# Altium schematic sheet 5V Buck Boost Converter.SchDoc: 5V DC/DC Buck Boost Converter
size 292 x 193 mm; DocumentNumber: 7; SheetNumber: 3; SheetTotal: 42
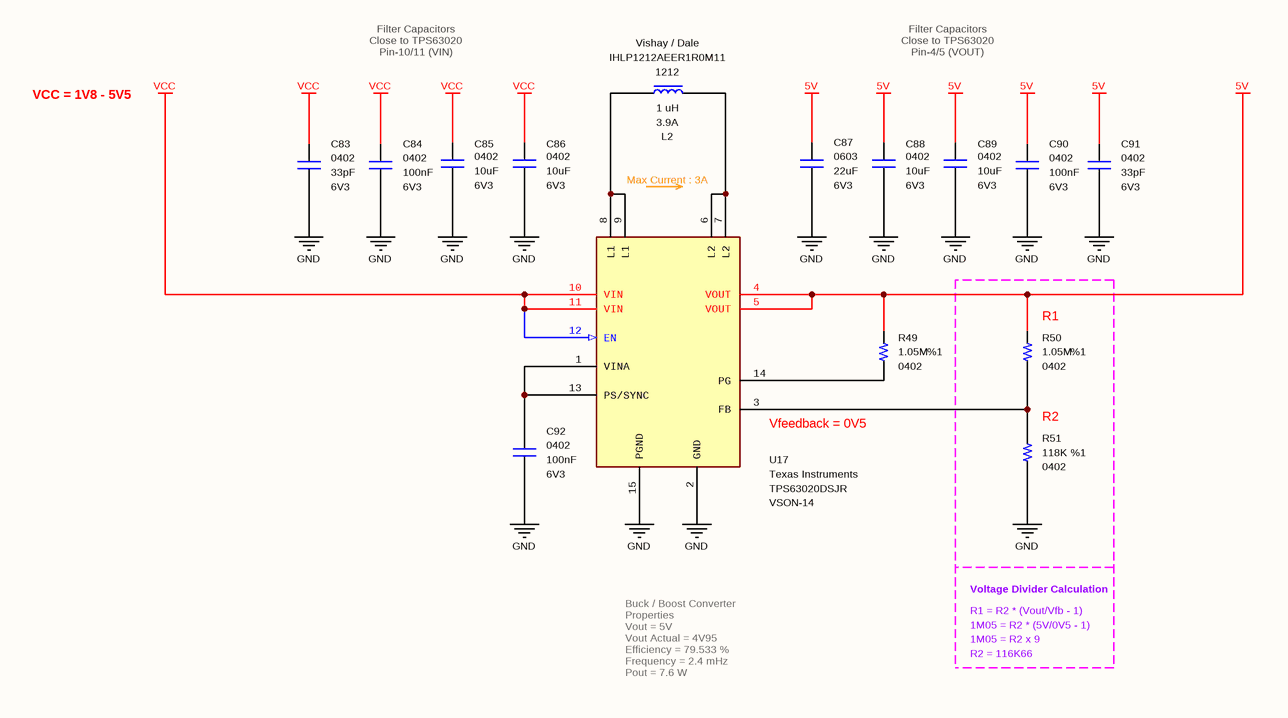
[diagram p0: 5V Buck Boost Converter.SchDoc]

## Parts
C83  value 33pF  Case: 0402  Voltage: 6V3  [CAPACITOR_0402]  (hidden comment: Multilayer Ceramic Capacitor)
C84  value 100nF  Case: 0402  Voltage: 6V3  [CAPACITOR_0402]  (hidden comment: Multilayer Ceramic Capacitor)
C85  value 10uF  Case: 0402  Voltage: 6V3  [CAPACITOR_0402]  (hidden comment: Multilayer Ceramic Capacitor)
C86  value 10uF  Case: 0402  Voltage: 6V3  [CAPACITOR_0402]  (hidden comment: Multilayer Ceramic Capacitor)
C87  value 22uF  Case: 0603  Voltage: 6V3  [CAPACITOR_0603]  (hidden comment: Multilayer Ceramic Capacitors)
C88  value 10uF  Case: 0402  Voltage: 6V3  [CAPACITOR_0402]  (hidden comment: Multilayer Ceramic Capacitor)
C89  value 10uF  Case: 0402  Voltage: 6V3  [CAPACITOR_0402]  (hidden comment: Multilayer Ceramic Capacitor)
C90  value 100nF  Case: 0402  Voltage: 6V3  [CAPACITOR_0402]  (hidden comment: Multilayer Ceramic Capacitor)
C91  value 33pF  Case: 0402  Voltage: 6V3  [CAPACITOR_0402]  (hidden comment: Multilayer Ceramic Capacitor)
C92  value 100nF  Case: 0402  Voltage: 6V3  [CAPACITOR_0402]  (hidden comment: Multilayer Ceramic Capacitor)
L2  value 1 uH  Maximum DC Current: 3.9A  Case: 1212  Manufacturer Part Number: IHLP1212AEER1R0M11  Manufacturer Name: Vishay / Dale  [IHLP-1212]  (hidden comment: Vishay - IHLP1212AEER1R0M11)
R49  value 1.05M  Tolerance: %1  Case: 0402  [RESISTOR_0402]  (hidden comment: Thick Film Resistor)
R50  value 1.05M  Tolerance: %1  Case: 0402  [RESISTOR_0402]  (hidden comment: Thick Film Resistor)
R51  value 118K  Tolerance: %1  Case: 0402  [RESISTOR_0402]  (hidden comment: Thick Film Resistor)
U17  Manufacturer Part Number: TPS63020DSJR  Manufacturer Name: Texas Instruments  [VSON-14]  (hidden comment: Texas Instruments - TPS63020DSJR)

## Nets
5V: C87.2 C88.2 C89.2 C90.1 C91.2 R49.2 R50.2 U17.4(VOUT) U17.5(VOUT)
GND: C83.1 C84.2 C85.1 C86.1 C87.1 C88.1 C89.1 C90.2 C91.1 C92.2 R51.1 U17.2(GND) U17.15(PGND)
VCC: C83.2 C84.1 C85.2 C86.2 U17.10(VIN) U17.11(VIN) U17.12(EN)
NetC92_1: C92.1 U17.1(VINA) U17.13(PS/SYNC)
NetL2_1: L2.1 U17.8(L1) U17.9(L1)
NetL2_2: L2.2 U17.6(L2) U17.7(L2)
NetR49_1: R49.1 U17.14(PG)
NetR50_1: R50.1 R51.2 U17.3(FB)

## Notes on the sheet
- Filter Capacitors
  Close to TPS63020
  Pin-10/11 (VIN)
- Filter Capacitors
  Close to TPS63020
  Pin-4/5 (VOUT)
- VCC = 1V8 - 5V5
- (near R50) R1
- (near U17) Vfeedback = 0V5
- (near R51) R2
- 1M05 = R2 * (5V/0V5 - 1)
- R1 = R2 * (Vout/Vfb - 1)
- Voltage Divider Calculation
- Buck / Boost Converter Properties
  Vout = 5V
  Vout Actual = 4V95
  Efficiency = 79.533 %
  Frequency = 2.4 mHz
  Pout = 7.6 W
- 1M05 = R2 x 9
- R2 = 116K66
- © 2021 All rights reserved.
  This document may not, in whole or in part, be copied, photocopied, reproduced, translated or converted to any electronic or machine readable from without prior written permission of Mehmet Günce Akkoyun.
  Engineer contact : akkoyun@me.com
- Property of
- Engineer :
- Date :
- Size :
- A4
- Time :
- Project :
- Page :
- /
- Customer :
- Product ID :
- Module ID :
- Version :
- File :
- Revision :
- (in symbol IC - TPS63020DSJR) Max Current : 3A

## Library data of the parts
C83 C91 = Capacitor - 33pF [0402-6V3]: Capacitor - 33pF [0402] (Ceramic); Manufacturer Name: Kemet; Manufacturer Part Number: C0402C330J9RACAUTO; Dielectric: X7R; Tolerance: 10%; Height: 0.5mm; Maximum Operating Temperature: +125; Minimum Operating Temperature: -55; ROHS: Yes; ComponentLink1Description: DataSheet; ComponentLink1URL: https://api.kemet.com/component-edge/download/datasheet/C0402C330J9RACAUTO.pdf; ComponentLink2Description: Mouser; ComponentLink2URL: https://www.mouser.com/Search/Refine.aspx?Keyword=80-C0402C330J9RAUTO; Supplier 1: Mouser; Supplier Part Number 1: 80-C0402C330J9RAUTO; Mouser Part Number: 80-C0402C330J9RAUTO
C84 C90 C92 = Capacitor - 100nF [0402-6V3]: Capacitor - 100nF [0402-6V3] (Ceramic); Manufacturer Name: AVX; Manufacturer Part Number: 04026D104KAT4A; Dielectric: X5R; Tolerance: %10; Height: 0.25mm; ComponentLink1Description: Mouser; ComponentLink1URL: https://www.mouser.com.tr/ProductDetail/AVX/04026D104KAT4A?qs=sGAEpiMZZMs0AnBnWHyRQPg4iYkCw7IMED%2F4kpqgf7w%3D; ComponentLink2Description: DataSheet; ComponentLink2URL: https://www.mouser.com.tr/datasheet/2/40/cx5r-776519.pdf; ROHS: Yes; Maximum Operating Temperature: +85; Minimum Operating Temperature: -55; Supplier 1: Avnet; Supplier Part Number 1: 04026D104KAT4A; Mouser Part Number: 581-04026D104KAT4A
C85 C86 C88 C89 = Capacitor - 10uF [0402-6V3]: Capacitor - 10uF [0402] (Ceramic); Manufacturer Name: Kemet; Manufacturer Part Number: C0402C106M9PACTU; Dielectric: X5R; Tolerance: 20%; Height: 0.5mm; Mouser Part Number: 80-C0402C106M9P; Maximum Operating Temperature: +85; Minimum Operating Temperature: -55; RoHS: Yes; ComponentLink1Description: DataSheet; ComponentLink1URL: https://www.mouser.com.tr/datasheet/2/212/KEM_C1006_X5R_SMD-1103249.pdf; ComponentLink2Description: Mouser; ComponentLink2URL: https://www.mouser.com.tr/ProductDetail/KEMET/C0402C106M9PACTU?qs=sGAEpiMZZMs0AnBnWHyRQE3yiXa%2FuseC7%252BLTT67ezUCLPvFYe0E%252BJg%3D%3D; Supplier 1: Avnet; Supplier 2: Mouser; Supplier 3: Arrow; Supplier 4: Farnell; Supplier 5: Newark; Supplier 6: Farnell; Supplier 7: Digi-Key; Supplier 8: Newark; Supplier Part Number 1: C0402C106M9PACTU; Supplier Part Number 2: 80-C0402C106M9P; Supplier Part Number 3: C0402C106M9PACTU; Supplier Part Number 4: 2507061; Supplier Part Number 5: 75Y0593; Supplier Part Number 6: 2750752; Supplier Part Number 7: 399-13069-1-ND; Supplier Part Number 8: 29AC4166
C87 = Capacitor - 22uF [0603-6V3]: Capacitor - 22uF [0603] (Ceramic); Manufacturer Name: Murata; Manufacturer Part Number: GRM188R60J226MEA0D; Dielectric: X5R; Tolerance: %20; Height: 0.8mm; ComponentLink2Description: DataSheet; ComponentLink2URL: https://eu.mouser.com/datasheet/2/281/murata_03052018_GRM_Series_1-1310166.pdf; ROHS: Yes; Maximum Operating Temperature: +85; Minimum Operating Temperature: -55; Supplier 1: Newark; Supplier 2: Future Electronics; Supplier 3: Newark; Supplier 4: Avnet; Supplier 5: Avnet; Supplier 6: Digi-Key; Supplier 7: Mouser; Supplier 8: Digi-Key; Supplier 9: RSComponents; Supplier 10: Digi-Key; Supplier 11: Future Electronics; Supplier 12: Arrow Electronics; Supplier 13: Farnell; Supplier 14: Farnell; Supplier 15: Farnell; Supplier 16: Future Electronics; Supplier 17: Future Electronics; Supplier 18: RSComponents; Supplier 19: RSComponents; Supplier Part Number 1: 55Y9854; Supplier Part Number 2: 7104049; Supplier Part Number 3: 03AC2653; Supplier Part Number 4: 55Y9854; Supplier Part Number 5: GRM188R60J226MEA0D; Supplier Part Number 6: 490-7611-1-ND; Supplier Part Number 7: 81-GRM188R60J226ME0D; Supplier Part Number 8: 490-7611-6-ND; Supplier Part Number 9: 8847251; Supplier Part Number 10: 490-7611-2-ND; Supplier Part Number 12: GRM188R60J226MEA0D; Supplier Part Number 13: 2494232; Supplier Part Number 14: 2494232RL; Supplier Part Number 15: 2666490; Supplier Part Number 11: 2030727; Supplier Part Number 16: GRM188R60J226MEA0D-CUTT; Supplier Part Number 17: GRM188R60J226MEA0D-REEL; Supplier Part Number 18: 1449045; Supplier Part Number 19: 8847251P
L2 = Inductor - 1 uH [1212]: Fixed Inductors 1uH 20%; Maximum DC Resistance: 33 mOhms; Height: 1.2mm; ComponentLink1Description: DataSheet; ComponentLink1URL: https://www.mouser.com.tr/datasheet/2/445/7443551130-1721712.pdf; ComponentLink2Description: Mouser; ComponentLink2URL: https://www.mouser.com.tr/ProductDetail/Wurth-Elektronik/7443551130?qs=%2Fha2pyFaduhqRAqaB9EFxxGemvWRqW7raK8BZ9C7YF%252B79iYidgbP5A%3D%3D; Maximum Operating Temperature: +125; Minimum Operating Temperature: -55; Tolerance: 20%; Supplier 1: Digi-Key; Supplier 2: Digi-Key; Supplier 3: Digi-Key; Supplier 4: Newark; Supplier 5: Newark; Supplier 6: Avnet; Supplier 7: Arrow Electronics; Supplier 8: Mouser; Supplier 9: Newark; Supplier 10: Future Electronics; Supplier 11: Future Electronics; Supplier 12: Farnell; Supplier 13: Farnell; Supplier 14: Farnell; Supplier 15: Avnet; Supplier 16: Future Electronics; Supplier 17: Future Electronics; Supplier 18: Newark; Supplier Part Number 1: 541-1327-1-ND; Supplier Part Number 2: 541-1327-6-ND; Supplier Part Number 3: 541-1327-2-ND; Supplier Part Number 4: 27T2308; Supplier Part Number 5: 38AH0532; Supplier Part Number 6: IHLP1212AEER1R0M11; Supplier Part Number 7: IHLP1212AEER1R0M11; Supplier Part Number 8: 70-IHLP1212AEER1R0M1; Supplier Part Number 18: 64T3094; Supplier Part Number 17: IHLP1212AEER1R0M11-REEL; Supplier Part Number 16: IHLP1212AEER1R0M11-CUTT; Supplier Part Number 15: 27T2308; Supplier Part Number 14: 2056526RL; Supplier Part Number 12: 2392942; Supplier Part Number 11: 5038784; Supplier Part Number 10: 8098630; Supplier Part Number 13: 2056526; Supplier Part Number 9: 24T8255
R49 R50 = Resistor - 1.05M: Thick Film Resistors - SMD 1/16 W 1.05 Mohms 1%; Manufacturer Name: Vishay; Manufacturer Part Number: CRCW04021M05FKED; Height: 0.35mm; Mouser Part Number: 71-CRCW04021M05FKED; ComponentLink1Description: DataSheet; ComponentLink1URL: https://www.mouser.com.tr/datasheet/2/427/dcrcwe3-1762152.pdf; ComponentLink2Description: Mouser; ComponentLink2URL: https://www.mouser.com.tr/ProductDetail/Vishay-Dale/CRCW04021M05FKED?qs=sGAEpiMZZMu61qfTUdNhGwALI1ohWcNjjLjJuYicL5s%3D; Supplier 1: Mouser; Supplier 2: Digi-Key; Supplier Part Number 1: 71-CRCW04021M05FKED; Supplier Part Number 2: 541-1.05MLCT-ND
R51 = Resistor - 10K [0402]: Thick Film Resistors - SMD 1/16 W 118 Kohms 1%; Manufacturer Name: Vishay; Manufacturer Part Number: CRCW0402118KFKED; Height: 0.35mm; ComponentLink1Description: DataSheet; ComponentLink1URL: https://www.mouser.com.tr/datasheet/2/427/dcrcwe3-1762152.pdf; ComponentLink2Description: Mouser; ComponentLink2URL: https://eu.mouser.com/ProductDetail/Vishay-Dale/CRCW0402127KFKED?qs=sGAEpiMZZMu61qfTUdNhG2DpbjADlD3G3QqPJgESRYg%3D; Supplier 1: Digi-Key; Supplier 2: Digi-Key; Supplier 3: Digi-Key; Supplier 4: Newark; Supplier 5: Avnet; Supplier 6: RSComponents; Supplier 7: RSComponents; Supplier 8: Arrow Electronics; Supplier 9: Mouser; Supplier Part Number 1: 541-118KLCT-ND; Supplier Part Number 2: 541-118KLDKR-ND; Supplier Part Number 3: 541-118KLTR-ND; Supplier Part Number 4: 52K6643; Supplier Part Number 5: 52K6643; Supplier Part Number 6: 6788728P; Supplier Part Number 7: 6788728; Supplier Part Number 8: CRCW0402118KFKED; Supplier Part Number 9: 71-CRCW0402-118K-E3
U17 = IC - TPS63020DSJR: Switching Voltage Regulators 93% Eff Buck-Boost Converter; Height: 1mm; ComponentLink1Description: DataSheet; ComponentLink1URL: http://www.ti.com/general/docs/suppproductinfo.tsp?distId=26&gotoUrl=http%3A%2F%2Fwww.ti.com%2Flit%2Fgpn%2Ftps63020; ROHS: Yes; Minimum Operating Temperature: -40 C; Maximum Operating Temperature: +85 C; ComponentLink2Description: Product Page; ComponentLink2URL: https://www.ti.com/product/TPS63020; Supplier 1: Digi-Key; Supplier 2: Digi-Key; Supplier 3: Digi-Key; Supplier 4: Mouser; Supplier 5: Arrow Electronics; Supplier 6: Newark; Supplier 7: Bison Technologies; Supplier 8: Bison Technologies; Supplier 9: Farnell; Supplier 10: Farnell; Supplier 11: Farnell; Supplier 12: Farnell; Supplier 13: Avnet; Supplier 14: Digi-Key; Supplier 15: Farnell; Supplier 16: Newark; Supplier 17: Newark; Supplier 18: Newark; Supplier Part Number 1: 296-36491-1-ND; Supplier Part Number 2: 296-36491-6-ND; Supplier Part Number 3: 296-36491-2-ND; Supplier Part Number 4: 595-TPS63020DSJR; Supplier Part Number 5: TPS63020DSJR; Supplier Part Number 6: 28AH6014; Supplier Part Number 7: TPS63020DSJR-211084-TI; Supplier Part Number 8: TPS63020DSJR-95326-TEXAS INSTRUMENTS; Supplier Part Number 9: 3007457; Supplier Part Number 10: 2781753; Supplier Part Number 11: 2781753RL; Supplier Part Number 12: 3007457RL; Supplier Part Number 13: TPS63020DSJR; Supplier Part Number 14: TPS63020DSJR-ND; Supplier Part Number 15: 2542792; Supplier Part Number 16: 44AC7695; Supplier Part Number 17: 74R6637; Supplier Part Number 18: 81Y9813; Case: VSON-14